# EAGLE design NinjaScanPseudo (EAGLE 7.0.0)
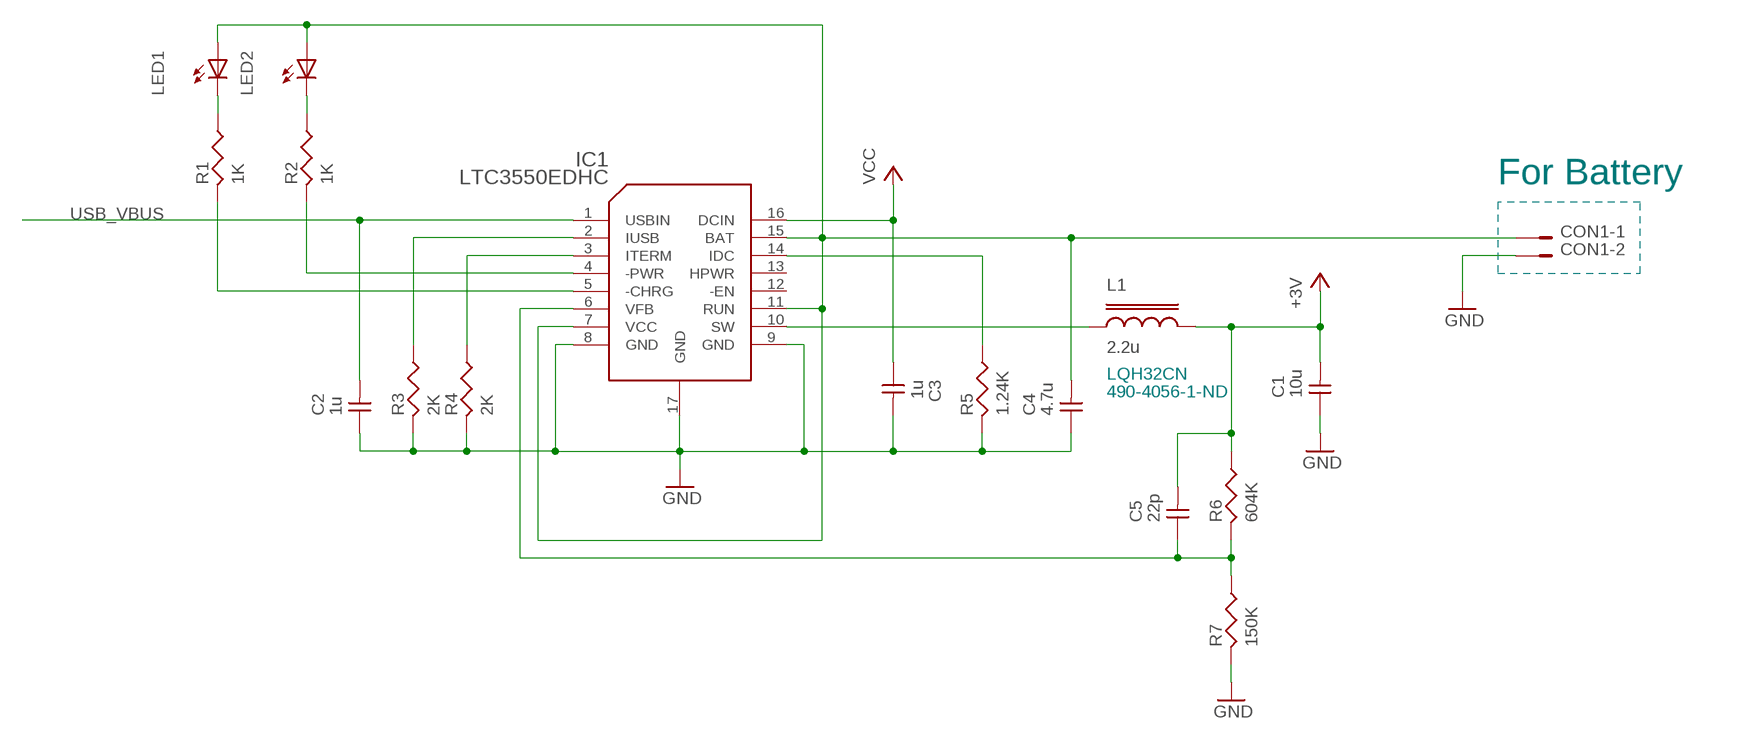
[diagram p0: schematic, sheet 1, part 1 of 2]
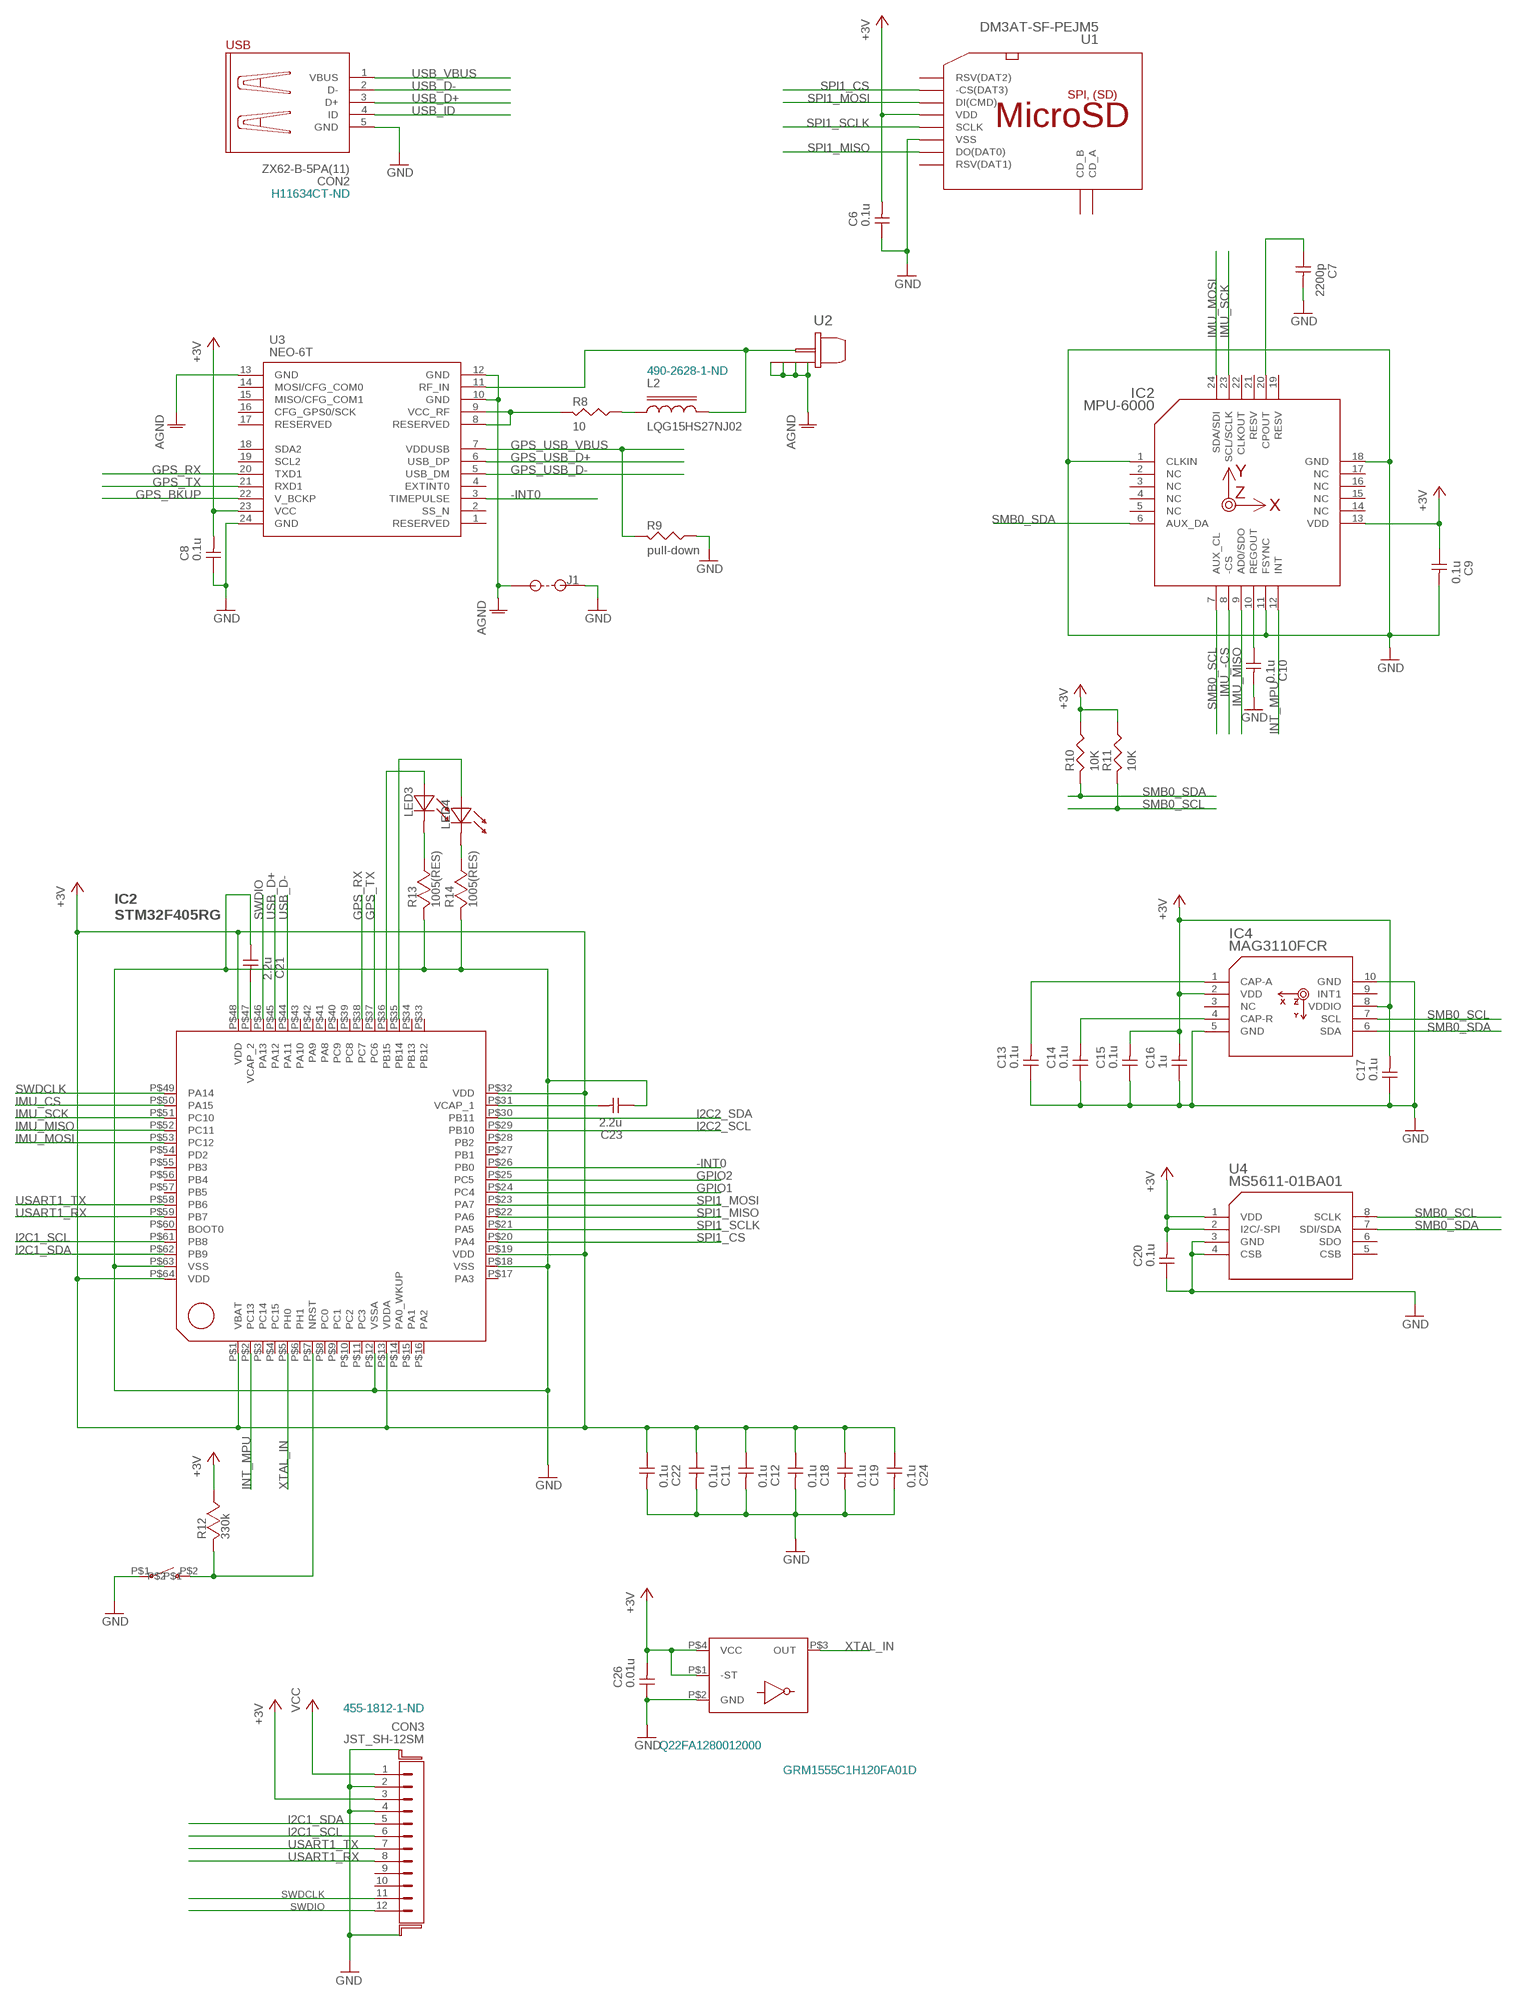
[diagram p1: schematic, sheet 1, part 2 of 2]

## Parts
C1  10u  C3216  [3216]
C2  1u  C1005  [1005]
C3  1u  C1005  [1005]
C4  4.7u  C2012  [2012]
C5  22p  C1005  [1005]
C6  0.1u  C1005  [1005]
C7  2200p  C1005  [1005]
C8  0.1u  C1005  [1005]
C9  0.1u  C1005  [1005]
C10  0.1u  C1005  [1005]
C11  0.1u  C1005  [1005]
C12  0.1u  C1005  [1005]
C13  0.1u  C1005  [1005]
C14  0.1u  C1005  [1005]
C15  0.1u  C1005  [1005]
C16  1u  C1005  [1005]
C17  0.1u  C1005  [1005]
C18  0.1u  C1005  [1005]
C19  0.1u  C1005  [1005]
C20  0.1u  C1005  [1005]
C21  2.2u  C1005  [1005]
C22  0.1u  C1005  [1005]
C23  2.2u  C1005  [1005]
C24  0.1u  C1005  [1005]
C26  0.01u  C1005  [1005]
CON1  JST_ZH-2B(MM)  [JST_ZH-2B(MM)]
CON2  ZX62-B-5PA(11)  ZX62-AB-5PA  [ZX62-AB-5PA]
CON3  JST_SH-12SM  [JST_SH-SM12B]
IC1  LTC3550EDHC  [DFN16BP]
IC2  MPU-6000  [QFN24]
IC4  MAG3110FCR  [DFN10]
J1  JUMPER1608  [1608]
L1  2.2u  L3225  [3225]
L2  LQG15HS27NJ02  L1005  [1005]
LED1  LED1608  [1608D]
LED2  LED1608  [1608D]
LED3  LED3  1608(LED)  [1608]
LED4  1608(LED)  [1608]
R1  1K  R1005  [1005]
R2  1K  R1005  [1005]
R3  2K  R1005  [1005]
R4  2K  R1005  [1005]
R5  1.24K  R1005  [1005]
R6  604K  R1005  [1005]
R7  150K  R1005  [1005]
R8  10  R1005  [1005]
R9  pull-down  R1005  [1005]
R10  10K  R1005  [1005]
R11  10K  R1005  [1005]
R12  330k  1005(RES)  [1005]
R13  1005(RES)  [1005]
R14  1005(RES)  [1005]
U1  DM3AT-SF-PEJM5  DM3A-SF-PEJ2  [DM3]
U2  H.FL  [H.FL]
U3  NEO-6T  [NEO]
U4  MS5611-01BA01  [LGA8]
U$6  STM32F405_64  [TQFP-64]
U$8  OMRON_B3U_1000P  [B3U_1000P]
U$15  SG-210  [EPSON_2.5X2.0X0.8MM]

## Nets
+3V: C1.2 C5.P$2 C6.P$2 C8.P$2 C9.P$1 C11.P$1 C12.P$1 C15.P$2 C16.P$2 C17.P$2 C18.P$1 C19.P$1 C20.P$2 C22.P$1 C24.P$1 C26.P$2 CON3.3 IC2.13(VDD) IC4.2(VDD) IC4.8(VDDIO) L1.2 R6.P$1 R10.P$1 R11.P$1 R12.P$2 U1.4(VDD) U3.23(VCC) U4.1(VDD) U4.2(I2C/-SPI) U$6.P$1(VBAT) U$6.P$13(VDDA) U$6.P$19(VDD) U$6.P$32(VDD) U$6.P$48(VDD) U$6.P$64(VDD) U$15.P$1(-ST) U$15.P$4(VCC)
-INT0: U3.3(TIMEPULSE) U$6.P$26(PB0)
AGND: J1.P$1 U2.GND@1(GND) U2.GND@2(GND) U2.GND@3(GND) U3.10(GND) U3.12(GND) U3.13(GND)
GND: C1.1 C2.P$1 C3.P$2 C4.1 C6.P$1 C7.P$2 C8.P$1 C9.P$2 C10.P$2 C11.P$2 C12.P$2 C13.P$1 C14.P$1 C15.P$1 C16.P$1 C17.P$1 C18.P$2 C19.P$2 C20.P$1 C21.P$1 C22.P$2 C23.P$1 C24.P$2 C26.P$1 CON1.2 CON2.5(GND) CON3.2 CON3.4 CON3.GUIDE@L(GUIDE) CON3.GUIDE@R(GUIDE) IC1.8(GND) IC1.9(GND) IC1.17(GND) IC2.1(CLKIN) IC2.11(FSYNC) IC2.18(GND) IC4.5(GND) IC4.10(GND) J1.P$2 R3.P$2 R4.P$2 R5.P$2 R7.P$2 R9.P$1 R13.P$1 R14.P$1 U1.6(VSS) U3.24(GND) U4.3(GND) U4.4(CSB) U$6.P$12(VSSA) U$6.P$18(VSS) U$6.P$63(VSS) U$8.P$1 U$15.P$2(GND)
GPIO1: U$6.P$24(PC4)
GPIO2: U$6.P$25(PC5)
GPS_BKUP: U3.22(V_BCKP)
GPS_RX: U3.20(TXD1) U$6.P$38(PC7)
GPS_TX: U3.21(RXD1) U$6.P$37(PC6)
GPS_USB_D+: U3.6(USB_DP)
GPS_USB_D-: U3.5(USB_DM)
GPS_USB_VBUS: R9.P$2 U3.7(VDDUSB)
I2C1_SCL: CON3.6 U$6.P$61(PB8)
I2C1_SDA: CON3.5 U$6.P$62(PB9)
I2C2_SCL: U$6.P$29(PB10)
I2C2_SDA: U$6.P$30(PB11)
IMU_-CS: IC2.8(-CS)
IMU_CS: U$6.P$50(PA15)
IMU_MISO: IC2.9(AD0/SDO) U$6.P$52(PC11)
IMU_MOSI: IC2.24(SDA/SDI) U$6.P$53(PC12)
IMU_SCK: IC2.23(SCL/SCLK) U$6.P$51(PC10)
INT_MPU: IC2.12(INT) U$6.P$2(PC13)
N$1: C10.P$1 IC2.10(REGOUT)
N$2: C23.P$2 U$6.P$31(VCAP_1)
N$3: C7.P$1 IC2.20(CPOUT)
N$4: LED4.P$1 U$6.P$35(PB14)
N$5: LED3.P$2 R13.P$2
N$6: L2.P$1 R8.P$1
N$7: L2.P$2 U2.SIG(C) U3.11(RF_IN)
N$8: R8.P$2 U3.8(RESERVED) U3.9(VCC_RF)
N$9: LED1.K R1.P$1
N$10: LED4.P$2 R14.P$2
N$11: LED2.K R2.P$1
N$12: IC1.2(IUSB) R3.P$1
N$13: IC1.3(ITERM) R4.P$1
N$14: IC1.14(IDC) R5.P$1
N$15: C5.P$1 IC1.6(VFB) R6.P$2 R7.P$1
N$16: IC1.5(-CHRG) R1.P$2
N$17: IC1.10(SW) L1.1
N$18: IC1.4(-PWR) R2.P$2
N$19: C4.2 CON1.1 IC1.7(VCC) IC1.11(RUN) IC1.15(BAT) LED1.A LED2.A
N$20: LED3.P$1 U$6.P$36(PB15)
N$21: R12.P$1 U$6.P$7(NRST) U$8.P$2
N$22: C13.P$2 IC4.1(CAP-A)
N$29: C14.P$2 IC4.4(CAP-R)
N$31: C21.P$2 U$6.P$47(VCAP_2)
SMB0_SCL: IC2.7(AUX_CL) IC4.7(SCL) R11.P$2 U4.8(SCLK)
SMB0_SDA: IC2.6(AUX_DA) IC4.6(SDA) R10.P$2 U4.7(SDI/SDA)
SPI1_CS: U1.2(-CS(DAT3)) U$6.P$20(PA4)
SPI1_MISO: U1.7(DO(DAT0)) U$6.P$22(PA6)
SPI1_MOSI: U1.3(DI(CMD)) U$6.P$23(PA7)
SPI1_SCLK: U1.5(SCLK) U$6.P$21(PA5)
SWDCLK: CON3.11 U$6.P$49(PA14)
SWDIO: CON3.12 U$6.P$46(PA13)
USART1_RX: CON3.8 U$6.P$59(PB7)
USART1_TX: CON3.7 U$6.P$58(PB6)
USB_D+: CON2.3(D+) U$6.P$45(PA12)
USB_D-: CON2.2(D-) U$6.P$44(PA11)
USB_ID: CON2.4(ID)
USB_VBUS: C2.P$2 CON2.1(VBUS) IC1.1(USBIN)
VCC: C3.P$1 CON3.1 IC1.16(DCIN)
XTAL_IN: U$6.P$5(PH0) U$15.P$3(OUT)
Unconnected: CON3.9 CON3.10 IC1.12(-EN) IC1.13(HPWR) IC2.2(NC) IC2.3(NC) IC2.4(NC) IC2.5(NC) IC2.14(NC) IC2.15(NC) IC2.16(NC) IC2.17(NC) IC2.19(RESV) IC2.21(RESV) IC2.22(CLKOUT) IC4.3(NC) IC4.9(INT1) U1.1(RSV(DAT2)) U1.8(RSV(DAT1)) U1.CD_A U1.CD_B U3.1(RESERVED) U3.2(SS_N) U3.4(EXTINT0) U3.14(MOSI/CFG_COM0) U3.15(MISO/CFG_COM1) U3.16(CFG_GPS0/SCK) U3.17(RESERVED) U3.18(SDA2) U3.19(SCL2) U4.5(CSB) U4.6(SDO) U$6.P$3(PC14) U$6.P$4(PC15) U$6.P$6(PH1) U$6.P$8(PC0) U$6.P$9(PC1) U$6.P$10(PC2) U$6.P$11(PC3) U$6.P$14(PA0_WKUP) U$6.P$15(PA1) U$6.P$16(PA2) U$6.P$17(PA3) U$6.P$27(PB1) U$6.P$28(PB2) U$6.P$33(PB12) U$6.P$34(PB13) U$6.P$39(PC8) U$6.P$40(PC9) U$6.P$41(PA8) U$6.P$42(PA9) U$6.P$43(PA10) U$6.P$54(PD2) U$6.P$55(PB3) U$6.P$56(PB4) U$6.P$57(PB5) U$6.P$60(BOOT0)

## Notes on the sheet
- For Battery
- LQH32CN
- 490-4056-1-ND
- H11634CT-ND
- 490-2628-1-ND
- IC2
  STM32F405RG
- 455-1812-1-ND
- Q22FA1280012000
- GRM1555C1H120FA01D

## Power pins joined to a net without a drawn wire
GND: CON2.GUIDE@L1(GND) CON2.GUIDE@L3(GND) CON2.GUIDE@R1(GND) CON2.GUIDE@R3(GND) U1.GND@1(GND) U1.GND@2(GND) U1.GND@3(GND) U1.GND@4(GND)

## Library data of the parts
C1-C24 C26 = additional:C: Capacitor (Non-Polar)
CON1 = additional:JST_ZH-2*: JST_ZH-2 1.5mm pitch 2-pins Connector.
CON2 = additional:ZX62-AB-5PA: USB Micro-AB Connector
CON3 = additional:JST_SH-12*: JST SH-12pins
IC1 = main:LTC3550: LTC3550 Dual Input USB/AC Adapter Li-Ion Battery Charger with 600mA Buck Converter
IC2 = sensor:MPU-6000: MPU-6000 Motion Processing Unit, 6 + 3 DOF inertial sensor unit
IC4 = main:MAG3110: MAG3110 Three-Axis, Digital Magnetometer
J1 = additional:JUMPER: Jumper
L1 L2 = additional:L: Inductor
LED1 LED2 = additional:LED: Light Emitting Diode
LED3 LED4 = mami_pero:1608(LED)
R1-R11 = additional:R: Resistance
R12-R14 = mami_pero:1005(RES)
U1 = additional:DM3*-SF-PEJ: DM3*-SF-PEJ MicroSD socket.
U2 = gps:H.FL: Hirose H.FL SMT low profile coaxicial connector
U3 = gps:NEO-6*: NEO-6 u-blox 6 GPS Modules
U4 = sensor:MS5611-01BA*: MS5611-01BA01 Barometric Pressure Sensor, with LCP(01) / metal(03) cap
U$6 = mami_pero:STM32F405_64
U$8 = mami_pero:OMRON_B3U_1000P
U$15 = mami_pero:SG-210

## Board
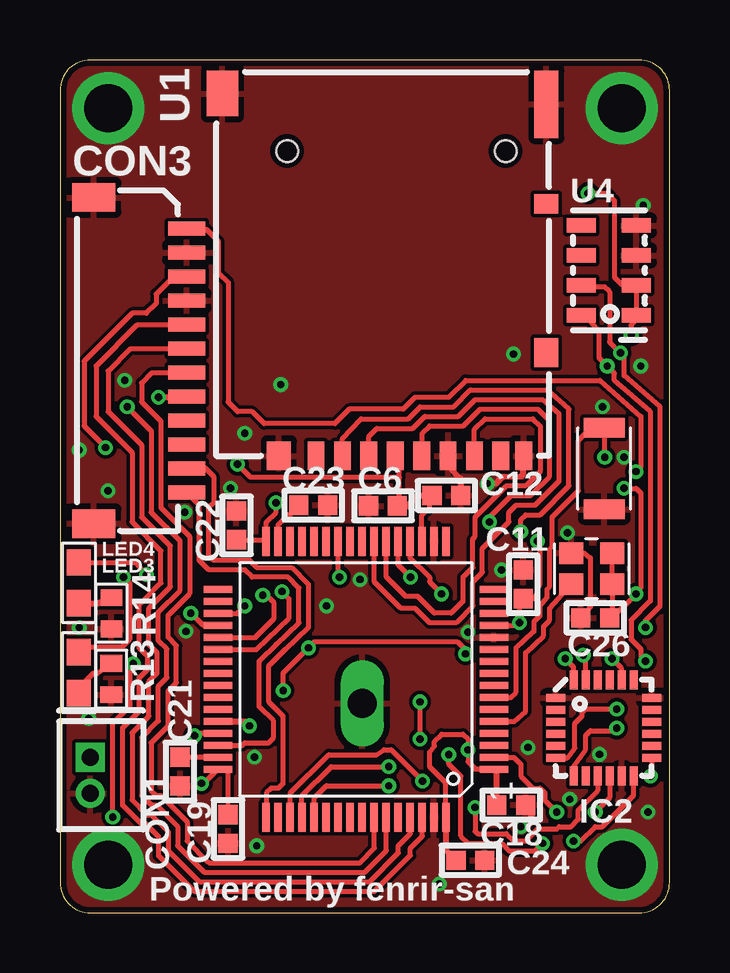
[diagram p2: board, top side]
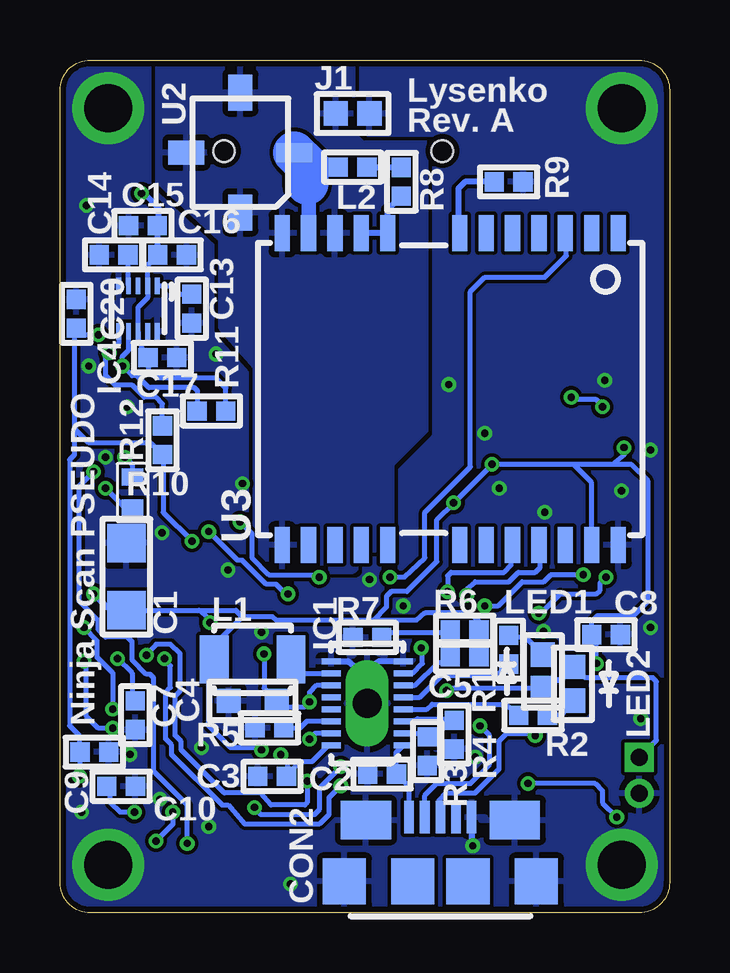
[diagram p3: board, bottom side, seen from below]

Size 25.4 x 35.56 mm. Coordinates in mm from the lower left corner, seen from the top.
Outline: 24.13,0 arc90 25.4,1.27 25.4,34.29 arc90 24.13,35.56 1.27,35.56 arc90 0,34.29 0,1.27 arc90 1.27,0 24.13,0
Copper layers (1*16): Top 0.035mm / dielectric 1.5mm / Bottom 0.035mm
Design rules "Elecrow_2-layer_eagle_rule": minimum track width 6mil, minimum drill 12mil, track to track 6mil, track to pad 6mil, pad to pad 6mil, via to via 6mil, smd to smd 0mil, copper to edge 10mil, drill to drill 10mil, minimum pad ring 10mil, minimum via ring 6mil, stop-mask expansion 2mil, vias tented up to drill 100mil, thermal gap 10mil
tRestrict: area 21.1,13.4 to 23.4,15.2

### Footprints (pad centres in the part's own frame; a part is rotated, then mirrored left to right if it is on the bottom)
3216 = smd 1.6 x 1.6: 1 -1.4,0; 2 1.4,0
1005 = smd 0.8 x 0.8: P$1 -0.6,0; P$2 0.6,0
2012 = smd 1 x 1: 1 -1,0; 2 1,0
JST_ZH-2B(MM) = drill 0.7 pad 1.118 square: 1 -0.75,0 | drill 0.7 pad 1.118: 2 0.75,0
ZX62-AB-5PA = smd 0.4 x 1.35: 1 -1.3,2.675; 2 -0.65,2.675; 3 0,2.675; 4 0.65,2.675; 5 1.3,2.675 | smd 2.1 x 1.6: GUIDE@L1 -3.1,2.55; GUIDE@R1 3.1,2.55 | smd 1.8 x 1.9: GUIDE@L2 -1.15,0; GUIDE@L3 -4,0; GUIDE@R2 1.15,0; GUIDE@R3 4,0
JST_SH-SM12B = smd 0.6 x 1.55: 1 -5.5,4.775; 2 -4.5,4.775; 3 -3.5,4.775; 4 -2.5,4.775; 5 -1.5,4.775; 6 -0.5,4.775; 7 0.5,4.775; 8 1.5,4.775; 9 2.5,4.775; 10 3.5,4.775; 11 4.5,4.775; 12 5.5,4.775 | smd 1.2 x 1.8: GUIDE@L -6.8,0.9; GUIDE@R 6.8,0.9
DFN16BP = smd 0.25 x 0.8: 1 -1.75,-1.5; 2 -1.25,-1.5; 3 -0.75,-1.5; 4 -0.25,-1.5; 5 0.25,-1.5; 6 0.75,-1.5; 7 1.25,-1.5; 8 1.75,-1.5; 9 1.75,1.5; 10 1.25,1.5; 11 0.75,1.5; 12 0.25,1.5; 13 -0.25,1.5; 14 -0.75,1.5; 15 -1.25,1.5; 16 -1.75,1.5 | drill 1.2 pad 1.6 long: 17 0,0
QFN24 = smd 0.8 x 0.32: 1 -2,1.25; 2 -2,0.75; 3 -2,0.25; 4 -2,-0.25; 5 -2,-0.75; 6 -2,-1.25; 13 2,-1.25; 14 2,-0.75; 15 2,-0.25; 16 2,0.25; 17 2,0.75; 18 2,1.25 | smd 0.32 x 0.8: 7 -1.25,-2; 8 -0.75,-2; 9 -0.25,-2; 10 0.25,-2; 11 0.75,-2; 12 1.25,-2; 19 1.25,2; 20 0.75,2; 21 0.25,2; 22 -0.25,2; 23 -0.75,2; 24 -1.25,2
DFN10 = smd 0.7 x 0.2: 1 -0.95,0.8; 2 -0.95,0.4; 3 -0.95,0; 4 -0.95,-0.4; 5 -0.95,-0.8; 6 0.95,-0.8; 7 0.95,-0.4; 8 0.95,0; 9 0.95,0.4; 10 0.95,0.8
1608 = smd 1.016 x 1.016: P$1 -0.7,0; P$2 0.7,0
3225 = smd 1.2 x 2: 1 -1.6,0; 2 1.6,0
1608D = smd 1.016 x 1.016: A -0.7,0; K 0.7,0
1608' = smd 1.1 x 1: P$1 0,0; P$2 1.7,0
1005' = smd 0.7 x 0.9: P$1 0,0; P$2 1.3,0
DM3 = smd 0.7 x 1.2: 1 0,0.6; 2 -1.1,0.6; 3 -2.2,0.6; 4 -3.3,0.6; 5 -4.4,0.6; 6 -5.5,0.6; 7 -6.6,0.6; 8 -7.7,0.6; GND@1 -8.65,0.6 | smd 1 x 0.8: CD_A -9.6,-9.9 | smd 1 x 1.2: CD_B -9.6,-3.7; GND@2 1.55,0.6 | smd 1.3 x 1.9: GND@3 3.9,-14.5 | smd 1 x 2.8: GND@4 -9.6,-14.05 | hole 0.889: 1.2,-12.1; -7.9,-12.1
H.FL = smd 1.5 x 1: GND@1 2.5,0; GND@3 -2.5,0 | smd 1 x 1.5: GND@2 0,2.25 | smd 0.8 x 1.5: SIG 0,-2.25
NEO = smd 1.5 x 0.635: 1 6.5,-7; 2 6.5,-5.9; 3 6.5,-4.8; 4 6.5,-3.7; 5 6.5,-2.6; 6 6.5,-1.5; 7 6.5,-0.4; 8 6.5,2.6; 9 6.5,3.7; 10 6.5,4.8; 11 6.5,5.9; 12 6.5,7; 13 -6.5,7; 14 -6.5,5.9; 15 -6.5,4.8; 16 -6.5,3.7; 17 -6.5,2.6; 18 -6.5,-0.4; 19 -6.5,-1.5; 20 -6.5,-2.6; 21 -6.5,-3.7; 22 -6.5,-4.8; 23 -6.5,-5.9; 24 -6.5,-7
LGA8 = smd 1.2 x 0.6: 1 -1.15,1.875; 2 -1.15,0.625; 3 -1.15,-0.625; 4 -1.15,-1.875; 5 1.15,-1.875; 6 1.15,-0.625; 7 1.15,0.625; 8 1.15,1.875
TQFP-64 = smd 0.3 x 1.2: P$1 0,0; P$2 0.5,0; P$3 1,0; P$4 1.5,0; P$5 2,0; P$6 2.5,0; P$7 3,0; P$8 3.5,0; P$9 4,0; P$10 4.5,0; P$11 5,0; P$12 5.5,0; P$13 6,0; P$14 6.5,0; P$15 7,0; P$16 7.5,0; P$33 7.5,11.5; P$34 7,11.5; P$35 6.5,11.5; P$36 6,11.5; P$37 5.5,11.5; P$38 5,11.5; P$39 4.5,11.5; P$40 4,11.5; P$41 3.5,11.5; P$42 3,11.5; P$43 2.5,11.5; P$44 2,11.5; P$45 1.5,11.5; P$46 1,11.5; P$47 0.5,11.5; P$48 0,11.5 | smd 1.2 x 0.3: P$17 9.5,2; P$18 9.5,2.5; P$19 9.5,3; P$20 9.5,3.5; P$21 9.5,4; P$22 9.5,4.5; P$23 9.5,5; P$24 9.5,5.5; P$25 9.5,6; P$26 9.5,6.5; P$27 9.5,7; P$28 9.5,7.5; P$29 9.5,8; P$30 9.5,8.5; P$31 9.5,9; P$32 9.5,9.5; P$49 -2,9.5; P$50 -2,9; P$51 -2,8.5; P$52 -2,8; P$53 -2,7.5; P$54 -2,7; P$55 -2,6.5; P$56 -2,6; P$57 -2,5.5; P$58 -2,5; P$59 -2,4.5; P$60 -2,4; P$61 -2,3.5; P$62 -2,3; P$63 -2,2.5; P$64 -2,2
B3U_1000P = smd 0.8 x 1.7: P$1 0,0; P$2 3.4,0
EPSON_2.5X2.0X0.8MM = smd 1 x 0.9: P$1 0,0; P$2 1.7,0; P$3 1.7,1.3; P$4 0,1.3

### Placement (x,y rotation side)
C1  22.63,14.02 270 bottom
C2  11.98,5.79 0 bottom
C3  16.56,5.7 180 bottom
C4  17.38,8.84 0 bottom
C5  8.54,10.67 0 bottom
C6  13.46,16.97 0 top
C7  22.27,8.24 270 bottom
C8  2.65,11.6 180 bottom
C9  23.97,6.71 0 bottom
C10  22.86,5.28 0 bottom
C11  19.3,13.7 90 top
C12  16.1,17.4 0 top
C13  19.91,25.2 90 bottom
C14  23.16,27.43 0 bottom
C15  21.95,28.65 0 bottom
C16  20.73,27.43 180 bottom
C17  21.13,23.16 180 bottom
C18  18.8,4.5 0 top
C19  7,3.5 270 top
C20  24.72,24.98 270 bottom
C21  5,5.9 90 top
C22  7.35,16.16 90 top
C23  10.55,17 180 top
C24  17.1,2.2 0 top
C26  22.3,12.3 0 top
CON1  1.26,5.74 270 top
CON2  9.55,1.32 0 bottom
CON3  0.51,23.03 270 top
IC1  12.6,8.74 90 bottom
IC2  22.66,7.72 0 top
IC4  22.15,25.2 270 bottom
J1  13.21,33.32 0 bottom
L1  17.38,10.58 180 bottom
L2  13.21,31.09 180 bottom
LED1  5.28,10.07 90 bottom
LED2  4.03,9.56 270 bottom
LED3  LED3  [1608']  0.78,10.87 270 top
LED4  1608(LED)  [1608']  0.78,14.61 270 top
R1  6.71,10.98 270 bottom
R2  5.69,8.24 180 bottom
R3  10.09,6.74 270 bottom
R4  8.98,7.43 270 bottom
R5  16.67,7.72 180 bottom
R6  8.54,11.79 180 bottom
R7  12.59,11.49 180 bottom
R8  11.18,30.48 270 bottom
R9  6.71,30.48 180 bottom
R10  21.13,19.71 90 bottom
R11  19.09,20.93 180 bottom
R12  330k  [1005']  22.37,18.18 270 bottom
R13  1005(RES)  [1005']  2.13,9.1 90 top
R14  1005(RES)  [1005']  2.14,11.84 90 top
U1  10.67,19.66 180 top
U2  17.88,31.7 90 bottom
U3  9.14,21.84 90 bottom
U4  22.86,26.79 180 top
U$6  18.08,5.99 90 top
U$8  22.67,16.83 90 top
U$15  23,15 180 top

### Tracks (layer width: path | path; a pad name or v marks a point on that pad's centre or on a via)
+3V  (via drill 0.3)
  Top 0.2: IC2.13 24.66,5.84 v24.6,5.7 | 4.73,26.53 4,25.8 4,25.4 3.6,25 3,25 1,23 1,20.3 v1.9,19.4 | v3.05,10.4 2.9,10.25 2.9,8.6 2.2,7.9 v2.2,4 | U$6.P$64 16.08,5.42 15.4,6.1 15.4,6.7 15.6,6.95 15.6,7.15 15.9,7.45 16.8,7.45 17,7.25 v17,6.8 17,6.3 17.3,6 18.27,6 U$6.P$1 | 8.6,15.51 8.6,16.3 9,16.7 v9,17.1 | C11.P$1 19.6,13.2 | C6.P$2 14.14,17.04 14.14,18.16 | 14.14,18.16 7.94,18.16 v7.4,18.7 | 14.14,18.16 14.14,18.88 | C22.P$1 8.61,15.56 U$6.P$32 | U$6.P$13 19.04,11.99 v19.15,12.1 19.15,13 C11.P$1 | v22,30 22.8,30 23.1,29.7 23.1,26.5 23.4,26.2 23.98,26.2 U4.2 | 24.18,26 U4.2 | U4.2 U4.1 24.21,24.91 23.8,24.5 v23.8,24.1 | 23.7,26.1 24.08,26.1 U4.2 | v23.5,17.7 24,17.7 24.2,17.5 24.2,13.55 v24,13.3 23.1,12.4 23,12.4 | U$6.P$19 15.08,16.58 15.4,16.9 15.4,17.3 C12.P$1 | C11.P$1 19.7,13.1 19.9,13.3 19.9,13.6 20,13.7 20,15.4 v19.9,15.5 | C19.P$1 7,5.99 U$6.P$48 6,5.4 v5.9,5.4 | 23,12.4 U$15.P$4 U$15.P$1 | 23,12.4 C26.P$2
  Top 0.254: 18.5,12 U$6.P$13 | 14.14,18.88 U1.4 | 15.3,17.19 C12.P$1 14.9,17.4 14.43,16.93 C6.P$2 | 7,5.97 U$6.P$48 | 18.37,6 U$6.P$1 18.2,5.97 C18.P$1 | U$6.P$64 16.08,2.62 C24.P$1 | 8.6,15.51 U$6.P$32 | CON3.3 4.73,26.53
  Bottom 0.2: C1.2 19.6,12.62 | 19.6,12.62 18.07,12.62 17.8,12.35 | 7.9,11.83 7.9,12.1 8.3,12.5 10.2,12.5 10.55,12.2 12.35,12.2 | C16.P$2 21.75,27.01 IC4.2 21.75,25.65 22.15,25.25 IC4.8 22.15,23.85 22,23.6 22,23.43 C17.P$2 21.7,23.13 21.7,22.6 21.4,22.3 18.9,22.3 18.49,21.89 R11.P$1 | C8.P$2 3.25,12.15 3,12.4 1.5,12.4 0.9,13 0.9,18 1.6,18.7 2.4,18.7 | L1.2 19.2,10.55 19.2,7.8 18.3,6.9 17.1,6.9 v17,6.8 | 2.4,18.7 4,18.7 | U3.23 3.24,17.94 4,18.7 | 4,18.7 v7.4,18.7 v9,17.1 9.7,16.4 9.7,14.65 10.95,13.4 11.6,13.4 11.8,13.2 11.8,12.75 12.35,12.2 | v1.9,19.4 1.9,19.1 2.4,18.7 | v24.6,5.7 24.57,5.73 C9.P$1 24.6,6.94 24.6,7.4 25,7.8 25,18.9 24.8,19.1 24.8,20.2 | v5.9,5.4 3.1,5.4 2.8,5.1 2.8,4.6 v2.2,4 | 21.1,19.08 21.1,16.7 v19.9,15.5 | R10.P$1 21.62,19.6 24.2,19.6 24.8,20.2 | 24.8,20.2 24.8,24.3 C20.P$2 24.44,24.1 v23.8,24.1 | R12.P$2 22.68,16.88 v23.5,17.7 | v19.15,12.1 19.2,12.27 19.6,12.62 | 12.35,12.2 16.4,12.2 16.55,12.35 17.8,12.35 | 17.8,12.35 19,11.15 | C8.P$2 3.25,11.45 | v3.05,10.4 3.05,11.41 C8.P$2
  Bottom 0.254: 21.1,19.08 R10.P$1 21.14,19.11 | 22.1,12.55 C1.2 22.16,12.8 23.45,12.75 v24,13.3 | 7.9,11.83 R6.P$1 C5.P$2 | C16.P$2 21.35,27.45 C15.P$2 21.3,28.7 21.3,29.4 21.9,30 v22,30 | L1.2 18.83,10.98 19,11.15 19.1,11.25 | 3.3,15.39 U3.23
-INT0  (via drill 0.3)
  Top 0.2: U$6.P$26 11.58,14.07 v11.65,14
  Bottom 0.2: v11.65,14 11.05,14 10.2,14.8 10.2,16.7 8.3,18.6 8.3,25.9 7.7,26.5 5.2,26.5 4.3,27.4 4.3,28.3 U3.3
AGND
  pour Bottom: 13.21,35.56 13.21,32.51 12.8,32.11 10.16,32.11 10.16,20.12 11.58,18.69 11.58,15.85 13.21,14.22 16.26,14.22 17.27,15.24 17.27,22.76 18.69,24.38 18.69,28.04 21.34,30.48 21.34,35.56
GND  (via drill 0.3, 0.3 pad 0.61, 2)
  Top 0.2: 18.5,18.2 19.2,18.2 | v17.8,17.9 18.2,17.9 18.3,18 | 18.5,18.2 18.3,18 | 18.5,18.2 18.4,18.2 18.3,18.1 | 18.3,18.1 18.2,18 | 18.3,18 18.3,18.1 | v19.2,3.6 19.7,4.1 19.7,4.7 C18.P$2 | 23.4,16.75 23.3,16.85 22.7,16.85 U$8.P$1 | U$15.P$2 21.85,15 22.1,14.8 22.1,12.75 C26.P$1
  Top 0.254: 16.8,17.5 C12.P$2 16.7,18.1 16.17,18.63 U1.6 | 19.2,18.2 19.3,18.3 19.3,19.04 U1.GND@1
  Bottom 0.254: IC1.8 12.11,10.49 12.8,10 | 12.8,10 12.8,8.94 IC1.17 | IC1.9 13.39,10.49 12.8,10 | CON2.5 8.25,2.75 v8.2,2.8
  other vias: 0.8,19.3 18.4,14.3 2.7,22.2 2,17.6 7.7,20 17,11.7 12.5,13.9 18.9,23.3 24.3,29.5 1.2,8.1 15.8,1.2 5.2,16.7 19.5,6.9 23.5,19 7.1,17.7 8.1,6.5 0.8,11.9 5.25,11.74 24.5,4.2 21.24,4.74 22.48,6.61 9.2,22.03 2,2 23.4,2 2,33.56 23.4,33.56 22.6,21.1 24.2,22.8 21.15,15.85 11.1,12.8
  pour Top (rank 2): 0,35.56 0,0 25.4,0 25.4,35.56
  pour Bottom (rank 2): 0,35.56 25.4,35.56 25.4,0 0,0
  pour Bottom: 20.93,26.82 23.37,26.82 23.37,23.57 20.93,23.57
GPS_RX  (via drill 0.3)
  Top 0.2: U$6.P$38 8.19,10.99 9.55,12.3 9.55,13.1 v9.25,13.4
  Bottom 0.2: U3.20 6.6,15.28 6.6,14.5 6.9,14.2 9.1,14.2 9.25,14.05 v9.25,13.4
  Bottom 0.254: 6.5,15.29 U3.20
GPS_TX  (via drill 0.3)
  Top 0.2: U$6.P$37 8.14,11.49 8.9,12.25 8.9,12.95 8.6,13.25 v8.45,13.25
  Bottom 0.2: v8.45,13.25 8.45,13.5 8.1,13.8 6.7,13.8 6.3,14.2 5.6,14.2 5.4,14.4 5.4,15.29
  Bottom 0.254: 5.4,15.29 U3.21
GPS_USB_VBUS
  Bottom 0.254: R9.P$2 8.52,30.48 8.8,30.2 8.8,28.09 U3.7
I2C1_SCL
  Top 0.2: 5.8,23.5 2.9,23.5 2,22.6 2,20.9 3.4,19.5 3.4,16.5 4.6,15.3 4.6,13.6 3.7,12.7 3.7,11.2 4.05,10.85 4.05,10 3.7,9.65 3.7,8.2 3,7.5 3,4.7 3.6,4.1 3.8,4.1 4.5,3.4 4.5,2.6 5.8,1.3 12.9,1.3 14.1,2.5 14.1,2.8 14.6,3.3 14.6,3.97 U$6.P$61 14.6,3.87
  Top 0.254: 5.8,23.5 5.9,23.6 5.35,23.6 CON3.6
I2C1_SDA
  Top 0.2: 5.25,24.5 3.2,24.5 1.5,22.8 1.5,20.7 3,19.2 3,16.3 4.2,15.1 4.2,13.75 3.3,12.85 3.3,11.05 3.65,10.7 3.65,10.15 3.3,9.8 3.3,8.4 2.6,7.7 2.6,4.5 3.4,3.7 3.6,3.7 4.1,3.2 4.1,2.4 5.6,0.9 13.1,0.9 14.6,2.4 14.6,2.7 15.1,3.2 15.1,3.97 U$6.P$62 15.1,3.87
  Top 0.254: 5.25,24.5 CON3.5
IMU_MISO  (via drill 0.3)
  Top 0.2: IC2.9 22.4,5.1 21.6,4.3 21.6,3.9 21.3,3.6 20.8,3.6 20.7,3.5 19.9,3.5 19.4,3 18.9,3 18.6,3.3 17.4,3.3 17.3,3.4 v17.3,4.39 v17.29,4.4 | U$6.P$52 10.08,4.88 11.3,6.1 v13.7,6.1
  Top 0.254: IC2.9
  Bottom 0.2: v13.7,6.1 14.6,5.2 14.6,4.3 14.8,4.1 17.02,4.1 v17.29,4.4
IMU_MOSI  (via drill 0.3)
  Top 0.2: 10.6,3.9 10.6,4.8 11.1,5.3 v13.7,5.3 | IC2.24 21.41,10.24 v21.05,10.6
  Top 0.254: 10.6,3.9 U$6.P$53
  Bottom 0.2: v13.7,5.3 14.2,4.8 14.2,4.1 14.6,3.7 17.7,3.7 18.4,4.5 18.65,4.5 20.75,6.6 20.75,7 21,7.25 21,9.2 20.8,9.4 20.8,10.3 v21.05,10.6
IMU_SCK  (via drill 0.3)
  Top 0.2: 9.6,3.71 9.6,5 11.2,6.6 13.2,6.6 13.5,6.8 13.8,6.8 v15.1,5.5 | IC2.23 21.91,10.61 v21.8,10.75
  Top 0.254: 9.6,3.71 U$6.P$51
  Bottom 0.2: v15.1,5.5 15.1,4.6 15.2,4.5 16.6,4.5 17.04,5 18.55,5 20.35,6.8 20.35,7.15 20.6,7.4 20.6,9.05 20.4,9.25 20.4,10.8 20.8,11.2 21.4,11.2 v21.8,10.75
INT_MPU  (via drill 0.3)
  Top 0.2: U$6.P$2 18.91,6.49 19.2,6.2 19.2,5.7 19.7,5.2 20,5.2 20.2,5 20.2,4.7 v20.7,4.2 | 23.9,5.91 IC2.12 23.9,4.9 22.6,3.6 22.3,3.6 21.7,3 v21.4,3
  Bottom 0.2: v20.7,4.2 20.7,3.7 v21.4,3
N$1  (via drill 0.3)
  Top 0.2: IC2.10 22.91,4.8 v22.3,4.2
  Bottom 0.2: v22.3,4.2 22.9,4.2 23.3,4.6 23.3,5.13 C10.P$1
N$2
  Top 0.2: 9.1,15.4 9.1,16.2 9.5,16.6 9.6,16.6 C23.P$2
  Top 0.254: 9.1,15.4 U$6.P$31
N$3  (via drill 0.3)
  Top 0.2: IC2.20 23.41,10.2 v23,10.6
  Bottom 0.2: C7.P$1 22.4,8.87 22.4,10 v23,10.6
N$4  (via drill 0.3)
  Top 0.2: 6.11,12.49 U$6.P$35 7.39,12.49 v7.7,12.8 | LED4.P$1 3.14,14.61 v3.6,14.1
  Bottom 0.2: v3.6,14.1 4.95,14.1 5.25,13.8 6.15,13.8 7.15,12.8 v7.7,12.8
N$5
  Top 0.2: 1.03,9.37 1.03,9.63 1.4,10 1.58,10 R13.P$2
  Top 0.254: LED3.P$2 1.03,9.37
N$6
  Bottom 0.254: R8.P$1 12.6,31.08 L2.P$1
N$7
  Bottom 0.254: L2.P$2 13.99,31.09 14.5,31.6 14.56,31.6 15.04,31.11
  Bottom 0.6: U3.11 15.04,30.24 15.1,30.4
  Bottom 1.778: 15.04,31.11 15.1,31.17 | 15.1,30.4 15.1,31.17 | 15.1,31.17 U2.SIG
N$8
  Bottom 0.254: R8.P$2 11.74,29.31 U3.8 U3.9
N$9
  Bottom 0.2: 6.63,11.5 6.01,11.5 LED1.K
  Bottom 0.254: LED1.K | 6.63,11.5 R1.P$1
N$10
  Top 0.254: LED4.P$2 1.55,12.91 R14.P$2
N$11
  Bottom 0.254: R2.P$1 4.53,8.24 LED2.K
N$12
  Bottom 0.2: IC1.2 10.24,7.49 R3.P$1
  Bottom 0.254: 10.04,7.49 R3.P$1 10.34,7.49
N$13
  Bottom 0.2: IC1.3 10.81,7.99 10.5,8.1 9.14,8.1 R4.P$1
  Bottom 0.254: 9.14,8 R4.P$1 9.12,7.99
N$14
  Bottom 0.2: 16.1,7.5 16.1,7.69 R5.P$1 16.05,7.7 15.4,7.7 15.11,7.99 IC1.14
  Bottom 0.254: 15.85,7.6 R5.P$1 16.05,7.6 | 16.1,7.5 16.2,7.5
N$15
  Bottom 0.2: 9.15,11.69 9.14,11.69 R6.P$2 9.25,11.69 11.79,11.69 | IC1.6 10.61,9.49 9.65,10.45 9.36,10.45 C5.P$1
  Bottom 0.254: 11.79,11.69 R7.P$1 | C5.P$1 R6.P$2
N$16
  Bottom 0.2: IC1.5 10.41,8.99 9.5,9.9 7.18,9.9 R1.P$2
N$17
  Bottom 0.2: 15.59,9.99 IC1.10
  Bottom 0.254: 15.59,9.99 L1.1
N$18
  Bottom 0.2: IC1.4 10.11,8.49 9.9,8.7 6.8,8.7 R2.P$2
  Bottom 0.254: 6.54,8.49 R2.P$2
N$19  (via drill 0.3)
  Top 0.2: v16.9,10.8 16.9,10.96 16.57,11.29 10.59,11.29 v10.35,11.05 9.3,10 v9.3,9.27 | v15,7.25 v15,8.8
  Bottom 0.2: IC1.7 10.71,9.99 10.3,10.4 10.3,11 | IC1.15 14.76,7.49 v15,7.25 | CON1.1 0.55,7.2 0.55,9.65 0.7,9.8 3.52,9.8 LED2.A 3.62,10 | 16.24,8.6 15.2,8.6 v15,8.8 15,9.2 14.7,9.5 IC1.11 | LED1.A 9.2,9.37 v9.3,9.27 | v16.9,10.8 16.9,9.36 C4.2
  Bottom 0.254: LED1.A 4.9,9.7 4.55,9.7 3.94,10.26 LED2.A 3.86,10 | 16.6,9 16.14,9 C4.2 | 10.3,11 v10.35,11.05 | 16.24,8.6 C4.2 | 16.4,8.7 16.42,8.7 C4.2
N$20  (via drill 0.3)
  Top 0.2: LED3.P$1 0.98,11.07 2.57,11.07 2.9,11.4 2.9,13.75 v2.65,14 | 6.79,12 5.95,12 v5.45,12.5 | 6.97,12 6.79,12 | 6.79,12 U$6.P$36
  Bottom 0.2: v5.45,12.5 5.35,12.5 4.55,13.3 3.05,13.3 2.9,13.45 2.9,13.75 v2.65,14
N$21  (via drill 0.3)
  Top 0.2: U$6.P$7 18.79,8.99 19,9.2 19,11.05 19.7,11.7 19.75,11.75 19.75,12.15 20,12.4 20,12.8 20.3,13.15 20.3,13.5 20.4,13.6 20.4,15.15 20.5,15.3 20.5,16.5 21.6,17.6 21.6,19.7 21.9,20 22.85,20 U$8.P$2 22.7,19.85 v22.7,19
  Bottom 0.2: R12.P$1 22.37,18.67 v22.7,19
N$22
  Bottom 0.2: IC4.1 20.85,26.15 20.5,25.8 C13.P$2
N$29
  Bottom 0.2: IC4.4 22.55,27.42 C14.P$2
N$31
  Top 0.2: 6.77,6.5 U$6.P$47 5.01,6.49 C21.P$2
  Top 0.254: 6.97,6.5 6.9,6.5 6.8,6.49 U$6.P$47
SMB0_SCL  (via drill 0.3)
  Top 0.2: U4.8 21.91,24.88 22.45,24.25 22.45,23.15 v22.8,22.8 23.1,22.5 23.1,22.2 24.6,20.9 24.6,13 23.8,12.2 23.8,11.4 24.2,11 24.2,10.7 v24.4,10.5 | IC2.7 21.41,6.11 21.9,6.8 21.9,7.4 22.1,7.6 23.1,7.6 v23.2,7.7
  Bottom 0.2: R11.P$2 19.66,21.2 19.66,21.76 19.8,21.9 21.7,21.9 22.2,22.4 22.4,22.4 v22.8,22.8 22.8,23.2 22.55,23.45 IC4.7 | v23.2,7.7 23.8,7.7 24.3,8.2 24.3,10.4 v24.4,10.5
SMB0_SDA  (via drill 0.3)
  Top 0.2: IC2.6 21.15,6.47 21.45,6.87 21.45,7.91 21.75,8.21 21.75,8.35 21.9,8.5 v23.2,8.5 | v24.4,11.9 24.4,12.2 25,12.8 25,21.1 23.5,22.4 23.5,23.2 v23.35,23.35 22.9,23.8 22.9,25.9 22.7,26.1 21.98,26.1 U4.7
  Bottom 0.2: 21.14,20.3 R10.P$2 21.13,21.23 21.4,21.5 21.9,21.5 22.4,22 23.1,22 23.5,22.4 23.5,23.2 v23.35,23.35 22.95,23.75 IC4.6 | v23.2,8.5 23.2,10 23.85,10.65 23.85,11.35 v24.4,11.9
SPI1_CS  (via drill 0.3)
  Top 0.2: U1.2 11.77,19.77 12.55,20.6 14.5,20.6 15,21.1 16.4,21.1 17.1,21.8 20.3,21.8 21.2,21 21.2,17.8 20,16.6 19.4,16.6 19.2,16.4 v19.2,15.9 | U$6.P$20 14.58,14.82 15.4,14 15.4,13.8 v15.9,13.3
  Bottom 0.2: v19.2,15.9 18,14.7 17.8,14.7 16.8,13.7 16.4,13.7 16,13.3 v15.9,13.3
SPI1_MISO
  Top 0.2: U1.7 17.27,20.17 17.7,20.6 19.7,20.6 20,20.3 20,18.4 19.4,17.8 18.6,17.8 17.3,16.5 17.3,15.7 17.2,15.6 17.2,14.4 16.8,14 16.8,13 16.3,12.5 15.6,12.5 14.9,13.2 14.4,13.2 13.6,14 13.6,15.37 U$6.P$22
SPI1_MOSI
  Top 0.2: U1.3 12.87,19.87 13.2,20.2 14.7,20.2 15.2,20.7 16.6,20.7 17.3,21.4 20.1,21.4 20.8,20.8 20.8,18 19.8,17 19,17 18.7,16.7 18.7,16.3 17.6,15.2 17.6,14.2 17.2,13.8 17.2,12.8 16.5,12.1 15.4,12.1 14.8,12.7 14.2,12.7 13.1,13.8 13.1,15.27 U$6.P$23
SPI1_SCLK  (via drill 0.3)
  Top 0.2: 15.1,19.33 15.1,20 15.4,20.3 16.8,20.3 17.5,21 19.9,21 20.4,20.5 20.4,18.2 19.6,17.4 18.8,17.4 17.9,16.5 v17.9,16.3 | U$6.P$21 14.08,14.52 v14.6,14
  Top 0.254: 15.1,19.33 U1.5
  Bottom 0.2: v17.9,16.3 17.4,15.8 17.4,14.8 16.7,14.1 14.7,14.1 v14.6,14
SWDCLK
  Top 0.2: CON3.11 5.3,18.55 6.05,18.55 6.4,18.2 6.4,17.1 6.2,16.9 6.2,14.9 6.4,14.7 7.9,14.7 8.2,14.4 9.65,14.4 10.35,13.7 10.35,11.9 9.4,11 8.7,10.3 8.7,8.8 9.3,8.2 9.3,5.4 9.1,5.2 8.8,5.2 8.6,5 8.6,4 U$6.P$49
  Top 0.254: 5.35,18.6 CON3.11
SWDIO
  Top 0.2: CON3.12 5.8,17.01 5.8,14.7 6.2,14.3 7.7,14.3 8,14 9.5,14 9.95,13.55 9.95,12.1 9,11.2 8.3,10.5 8.3,8.6 8.9,8 8.9,7.3 8.7,7.1 7.7,7.1 7.59,6.99 U$6.P$46
USART1_RX  (via drill 0.3)
  Top 0.2: v2.8,21.1 3.8,20.1 3.8,16.7 5,15.5 5,13.45 4.1,12.55 4.1,11.35 4.45,11 4.45,9.8 4.1,9.45 4.1,8 3.4,7.3 3.4,4.9 3.8,4.5 4,4.5 4.9,3.6 4.9,2.8 6,1.7 12.7,1.7 13.6,2.6 13.6,3.97 U$6.P$59
  Top 0.254: 5.21,21.6 CON3.8 5.25,21.5 v4.1,21.5
  Bottom 0.2: v2.8,21.1 2.8,21.15 3.05,21.4 4,21.4 v4.1,21.5
USART1_TX
  Top 0.2: 5.25,22.5 3.8,22.5 3.4,22.1 3.4,21.3 4.2,20.5 4.2,16.9 5.4,15.7 5.4,13.3 4.5,12.4 4.5,11.5 4.85,11.15 4.85,9.6 4.5,9.25 4.5,7.8 3.8,7.1 3.8,5.1 4,4.9 4.2,4.9 5.3,3.8 5.3,3 6.2,2.1 12.5,2.1 13.1,2.7 13.1,3.97 U$6.P$58
  Top 0.254: 5.25,22.5 CON3.7
USB_D+  (via drill 0.3)
  Top 0.2: U$6.P$45 5.7,7.49 v5.6,7.39
  Bottom 0.2: 9.6,4.15 9.6,4.7 9.3,5 8.1,5 7.1,6 7.1,7.17 6.78,7.49 5.69,7.49 v5.6,7.39
  Bottom 0.254: 9.6,4.15 CON2.3
USB_D-  (via drill 0.3)
  Top 0.254: U$6.P$44 7.71,7.99 v7.9,7.8
  Bottom 0.2: 10.2,4.1 10.2,4.9 9.7,5.4 8.3,5.4 7.5,6.2 7.5,7.4 v7.9,7.8
  Bottom 0.254: 10.2,4.1 CON2.2
USB_VBUS
  Bottom 0.2: CON2.1 10.85,5.26 C2.P$2 | 11.4,5.81 11.4,6.69 IC1.1
  Bottom 0.254: 11.4,5.81 C2.P$2
VCC  (via drill 0.3)
  Top 0.2: 5.31,28.5 6.1,28.5 6.6,28 6.6,26.7 7,26.3 7,21.3 7.4,20.9 8,20.9 8.5,20.4 11.45,20.4 12.05,21 14.3,21 14.8,21.5 16.2,21.5 16.9,22.2 22.5,22.2 24.2,20.7 24.2,18.6 v24,18.4 | v16.2,6.6 16.2,6.2 16.7,5.7 16.7,3.2 17,2.9 18.4,2.9 18.7,2.6 19.8,2.6 v20.1,2.9 19.9,2.7
  Top 0.254: 5.35,28.6 CON3.1 5.31,28.5
  Bottom 0.2: v20.1,2.9 20.1,4.5 21.5,5.9 21.5,9.8 21.65,9.95 21.8,9.95 22.4,10.55 22.4,11.3 22.6,11.5 23.5,11.5 23.8,11.8 23.8,12.2 24.6,13 24.6,17.8 v24,18.4 | 15.9,6.03 15.9,6.3 v16.2,6.6 | IC1.16 14.3,6.9 14.9,6.3 15.46,6.3 C3.P$1
  Bottom 0.254: 15.9,6.03 C3.P$1
XTAL_IN
  Top 0.2: U$6.P$5 18.94,7.99 19.4,8.4 19.4,10.85 20.15,11.55 20.15,11.95 20.4,12.2 20.4,12.7 U$15.P$3

### Text on the board
tPlace: Powered by fenrir-san
bPlace: Lysenko | Rev. A | Ninja Scan PSEUDO